# EAGLE design prutokomer (EAGLE 7.7.0)
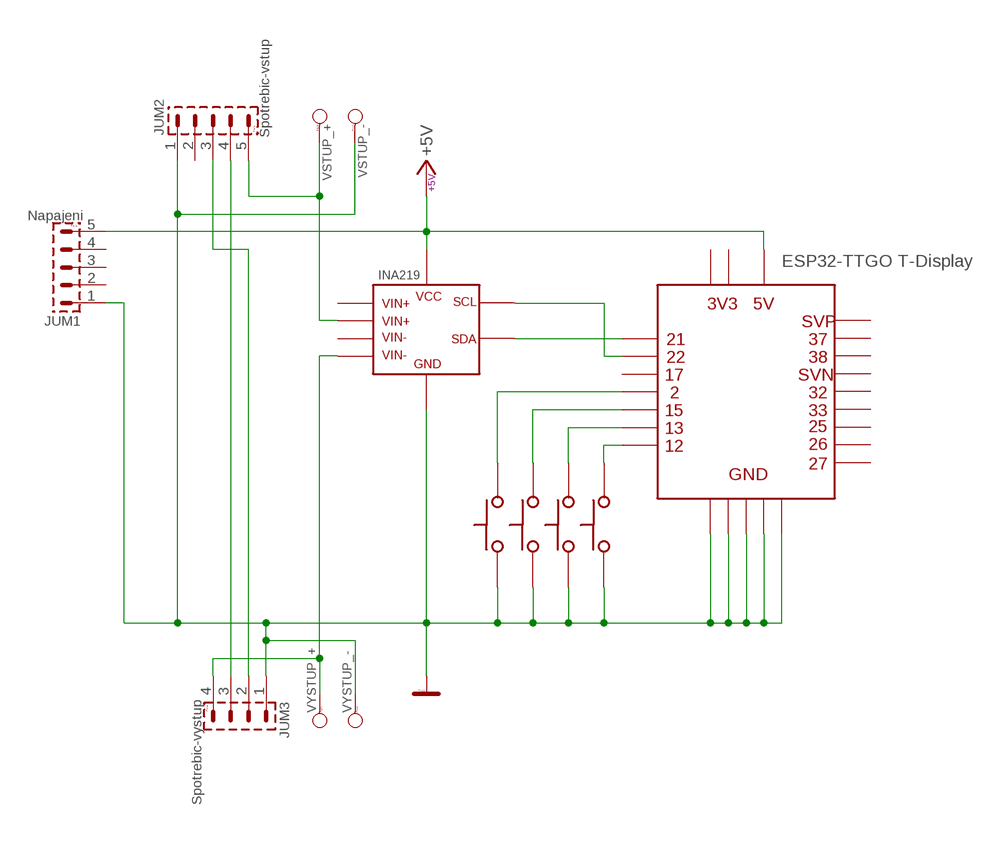
[diagram p0: schematic, sheet 1]

## Parts
JUM1  Napajeni  S1G5_JUMP  [S1G5_JUM]
JUM2  Spotrebic-vstup  S1G5_JUMP  [S1G5_JUM]
JUM3  Spotrebic-vystup  S1G4_JUMP  [S1G4_JUM]
SW1  TLACITKO  [TLACITKO]
SW2  TLACITKO  [TLACITKO]
SW3  TLACITKO  [TLACITKO]
SW4  TLACITKO  [TLACITKO]
U$1  INA219  [INA219]
U$2  ESP32_TTGOT-DISPLAY  [ESP32-TTGO-TDISPLAY]
VSTUP_+  PAD_1  [PAD_1]
VSTUP_-  PAD_1  [PAD_1]
VYSTUP_+  PAD_1  [PAD_1]
VYSTUP_-  PAD_1  [PAD_1]

## Nets
+5V: JUM1.5 U$1.VCC U$2.5V
GND: JUM1.1 JUM2.1 JUM3.1 SW1.1 SW2.1 SW3.1 SW4.1 U$1.GND U$2.GND1 U$2.GND2 U$2.GND3 U$2.GND4 U$2.GND5 VSTUP_-.1 VYSTUP_-.1
N$1: JUM2.5 U$1...VIN+(.VIN+) VSTUP_+.1
N$3: JUM3.4 U$1...VIN-(.VIN-) VYSTUP_+.1
N$4: U$1.SDA U$2.21
N$5: U$1.SCL U$2.22
N$6: JUM2.4 JUM3.3
N$7: JUM2.3 JUM3.2
N$8: SW4.2 U$2.12
N$9: SW3.2 U$2.13
N$10: SW2.2 U$2.15
N$11: SW1.2 U$2.2
Unconnected: JUM1.2 JUM1.3 JUM1.4 JUM2.2 U$1.VIN+ U$1.VIN- U$2.3V3 U$2.3V3-(3V3_2) U$2.17 U$2.25 U$2.26 U$2.27 U$2.32 U$2.33 U$2.37 U$2.38 U$2.SVN U$2.SVP

## Library data of the parts
JUM1 JUM2 = #PaJa_konektory:S1G5_JUMP: Radove konektory - koliky - 5x
JUM3 = #PaJa_konektory:S1G4_JUMP: Radove konektory - koliky - 4x
SW1-SW4 = tlacitko:TLACITKO
U$1 = INA219:INA219
U$2 = EPS32_TTGO_TDISPLAY:ESP32_TTGOT-DISPLAY
VSTUP_+ VSTUP_- VYSTUP_+ VYSTUP_- = #PaJa_31:PAD_1: Pajeci bod - 2,54 mm prumer

## Board
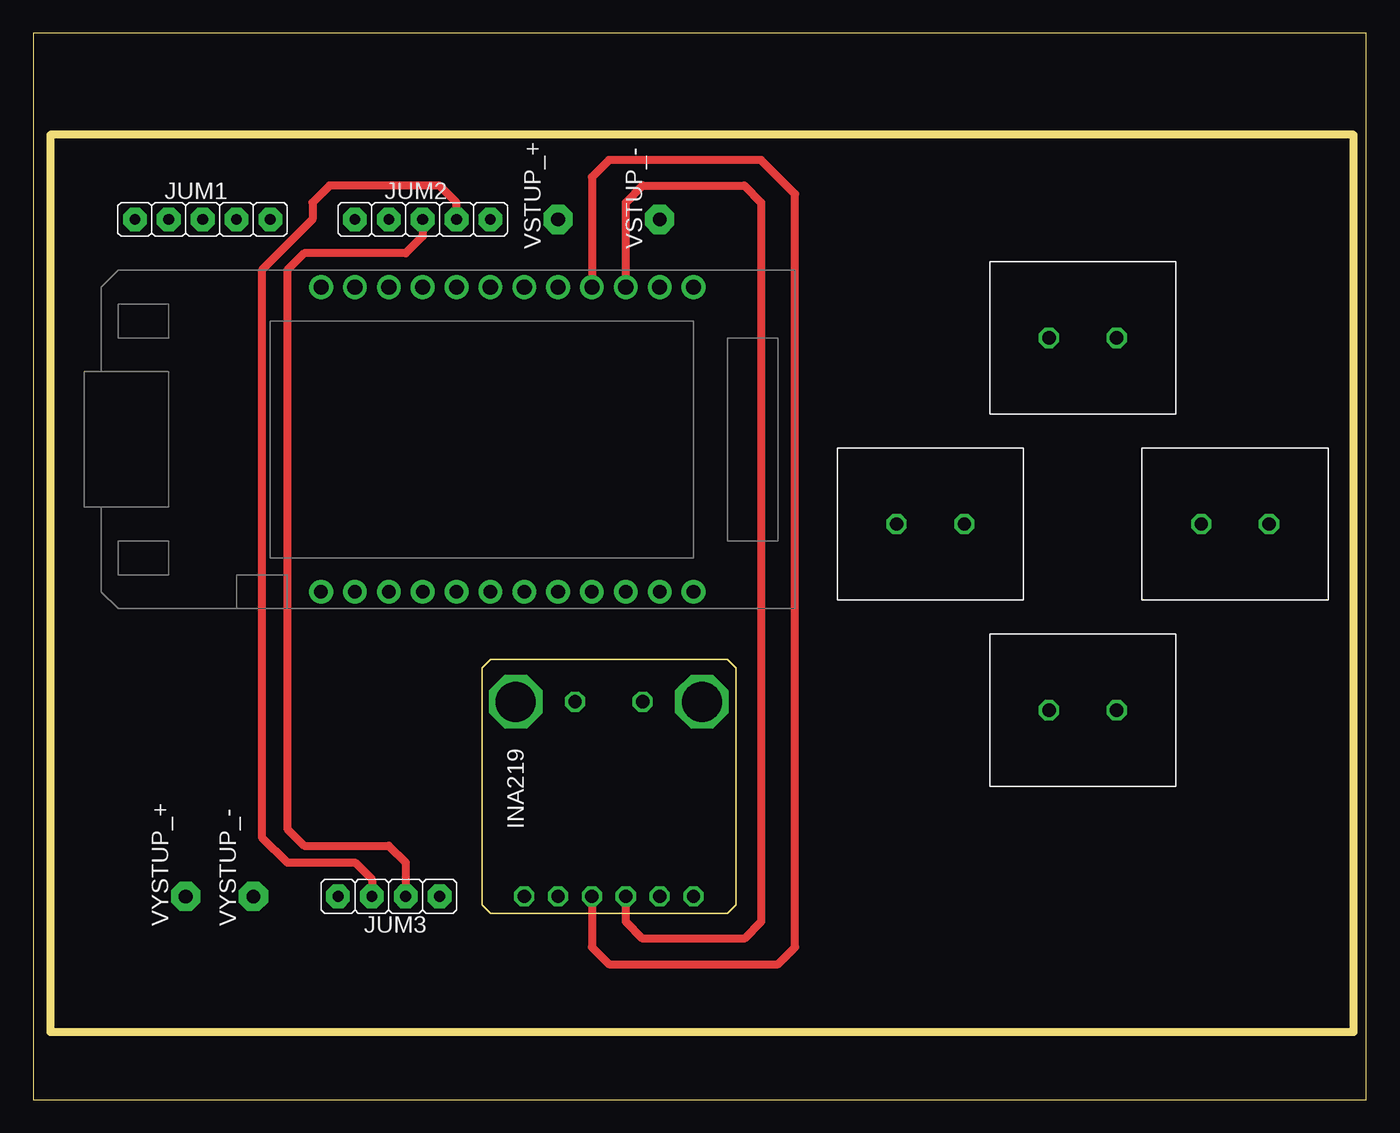
[diagram p1: board, top side]
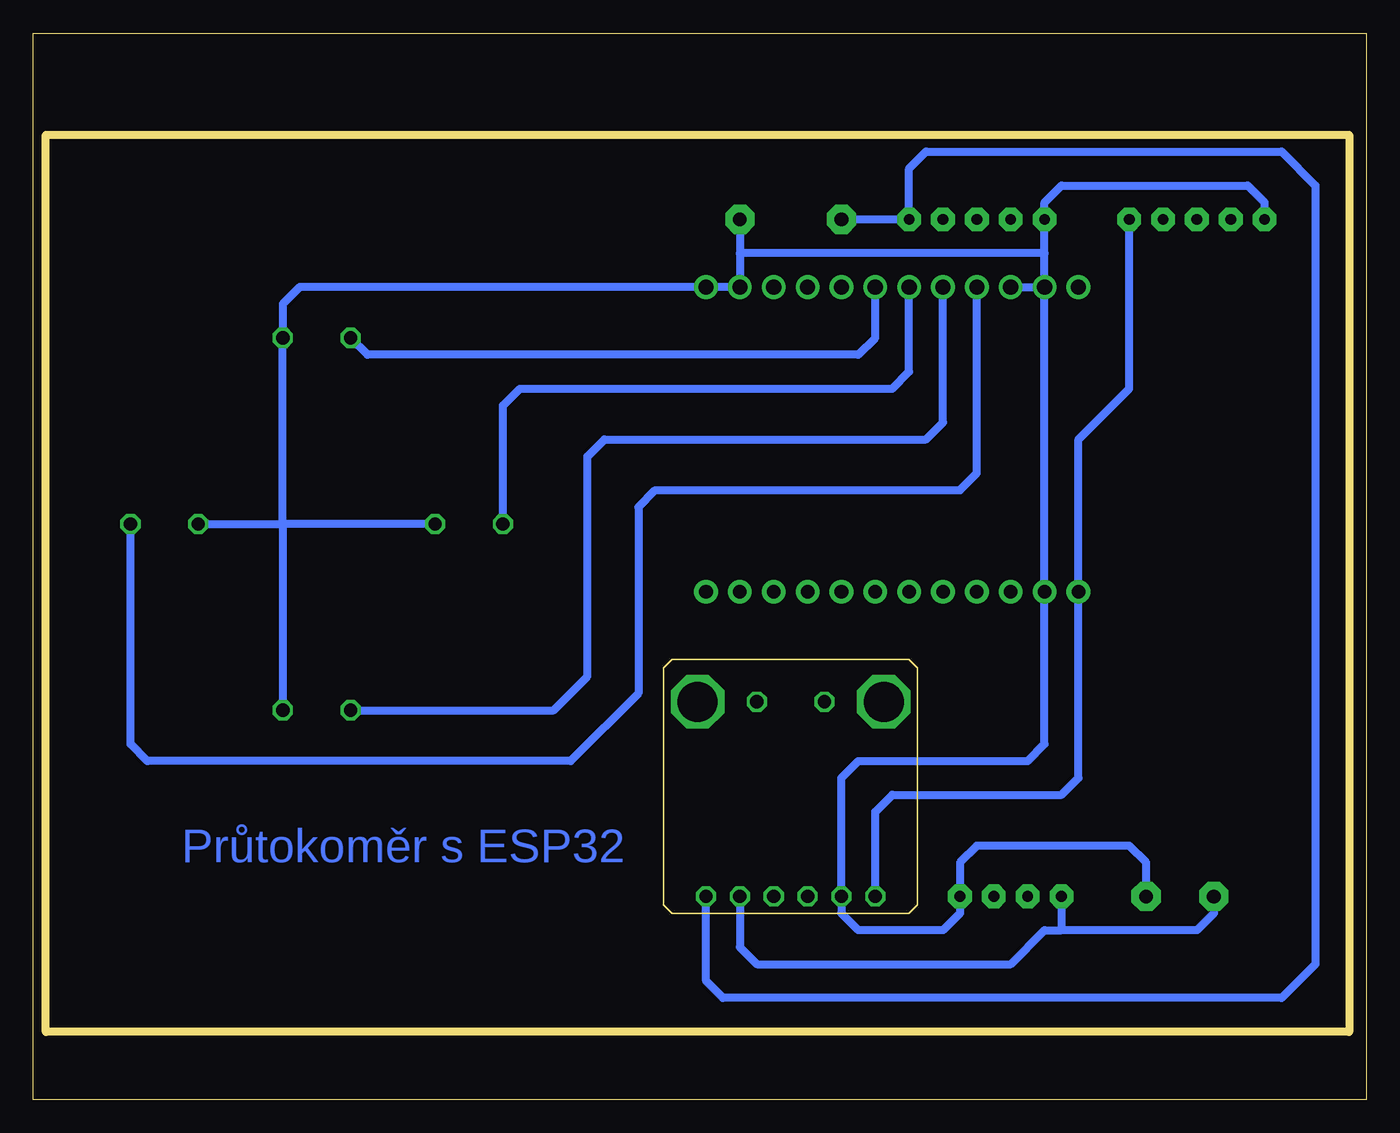
[diagram p2: board, bottom side, seen from below]

Size 100 x 80 mm. Coordinates in mm from the lower left corner, seen from the top.
Outline: 0,0 100,0 100,80 0,80 0,0
Outline: 1.27,72.39 1.27,5.08 99.06,5.08 99.06,72.39 1.27,72.39
Copper layers (1*16): Top 0.035mm / dielectric 1.5mm / Bottom 0.035mm
Design rules "default": minimum track width 10mil, minimum drill 24mil, track to track 8mil, track to pad 8mil, pad to pad 8mil, via to via 8mil, smd to smd 8mil, copper to edge 40mil, drill to drill 8mil, minimum pad ring 10mil, minimum via ring 8mil, stop-mask expansion 4mil, vias tented up to drill 0mil, thermal gap 10mil

### Footprints (pad centres in the part's own frame; a part is rotated, then mirrored left to right if it is on the bottom)
S1G5_JUM = drill 0.813 pad 1.778 octagon: 1 -5.08,0; 2 -2.54,0; 3 0,0; 4 2.54,0; 5 5.08,0
S1G4_JUM = drill 0.813 pad 1.778 octagon: 1 -3.81,0; 2 -1.27,0; 3 1.27,0; 4 3.81,0
TLACITKO = drill 1 octagon: 1 -2.54,0; 2 2.54,0
INA219 = drill 1 octagon: ..VIN+ 12.7,0; ..VIN- 10.16,0; .VIN+ 8.89,14.605; .VNI- 3.81,14.605; GND 2.54,0; SCL 5.08,0; SDA 7.62,0; VCC 0,0 | drill 3 octagon: VIN+ 13.335,14.605; VIN- -0.635,14.605
ESP32-TTGO-TDISPLAY = drill 1.143 pad 1.778: 2 0,15.24; 3V3 0,0; 12 0,7.62; 13 0,10.16; 15 0,12.7; 17 0,17.78; 21 0,22.86; 22 0,20.32; GND1 0,27.94; GND2 0,25.4; GND3 0,5.08; GND4 0,2.54 | drill 1.016 pad 1.778: 3V3- 22.86,27.94; 5V 22.86,0; 25 22.86,10.16; 26 22.86,7.62; 27 22.86,5.08; 32 22.86,15.24; 33 22.86,12.7; 37 22.86,22.86; 38 22.86,20.32; GND5 22.86,2.54; SVN 22.86,17.78; SVP 22.86,25.4
PAD_1 = drill 1.016 pad 2.184 octagon: 1 0,0

### Placement (x,y rotation side)
JUM1  12.7,66.04 0 top
JUM2  29.21,66.04 0 top
JUM3  26.67,15.24 180 top
SW1  78.74,57.15 180 top
SW2  67.31,43.18 180 top
SW3  78.74,29.21 180 top
SW4  90.17,43.18 0 top
U$1  36.83,15.24 0 top
U$2  21.59,60.96 270 top
VSTUP_+  39.37,66.04 90 top
VSTUP_-  46.99,66.04 90 top
VYSTUP_+  11.43,15.24 90 top
VYSTUP_-  16.51,15.24 90 top

### Tracks (layer width: path | path; a pad name or v marks a point on that pad's centre or on a via)
+5V
  Bottom 0.61: U$1.VCC 36.83,21.59 35.56,22.86 22.86,22.86 21.59,24.13 U$2.5V 21.59,49.53 17.78,53.34 JUM1.5
GND
  Bottom 0.61: 81.28,43.18 SW1.1 81.28,59.69 80.01,60.96 U$2.GND1 U$2.GND2 46.99,63.5 | SW2.1 81.28,43.18 | 24.13,63.5 JUM2.1 24.13,67.31 22.86,68.58 8.89,68.58 7.62,67.31 JUM1.1 | U$2.GND4 U$2.GND5 24.13,26.67 25.4,25.4 38.1,25.4 39.37,24.13 U$1.GND 39.37,13.97 38.1,12.7 31.75,12.7 30.48,13.97 JUM3.1 30.48,17.78 29.21,19.05 17.78,19.05 16.51,17.78 VYSTUP_-.1 | 81.28,43.18 SW3.1 | SW4.1 81.28,43.18 | VSTUP_-.1 46.99,63.5 | U$2.GND3 U$2.GND4 | U$2.GND4 24.13,63.5 | 24.13,63.5 46.99,63.5
N$1
  Bottom 0.61: VSTUP_+.1 JUM2.5 34.29,69.85 33.02,71.12 6.35,71.12 3.81,68.58 3.81,10.16 6.35,7.62 48.26,7.62 49.53,8.89 U$1...VIN+
N$3
  Bottom 0.61: VYSTUP_+.1 11.43,13.97 12.7,12.7 22.86,12.7 | U$1...VIN- 46.99,11.43 45.72,10.16 26.67,10.16 24.13,12.7 22.86,12.7 | JUM3.4 22.86,12.7
N$4
  Top 0.61: U$2.21 44.45,67.31 45.72,68.58 53.34,68.58 54.61,67.31 54.61,13.34 53.34,12.06 45.72,12.06 44.45,13.34 U$1.SDA
N$5
  Top 0.61: U$2.22 41.91,69.22 43.18,70.48 54.61,70.48 57.15,67.94 57.15,11.43 55.88,10.16 43.18,10.16 41.91,11.43 U$1.SCL
N$6
  Top 0.61: JUM2.4 31.75,67.31 30.48,68.58 22.23,68.58 20.95,67.31 20.95,66.04 17.14,62.23 17.14,19.68 19.05,17.78 24.13,17.78 25.4,16.51 JUM3.3
N$7
  Top 0.61: JUM2.3 29.21,64.77 27.94,63.5 20.32,63.5 19.05,62.23 19.05,20.32 20.32,19.05 26.67,19.05 27.94,17.78 JUM3.2
N$8
  Bottom 0.61: U$2.12 29.21,46.99 30.48,45.72 53.34,45.72 54.61,44.45 54.61,30.48 59.69,25.4 91.44,25.4 92.71,26.67 SW4.2
N$9
  Bottom 0.61: U$2.13 31.75,50.8 33.02,49.53 57.15,49.53 58.42,48.26 58.42,31.75 60.96,29.21 SW3.2
N$10
  Bottom 0.61: SW2.2 64.77,52.07 63.5,53.34 35.56,53.34 34.29,54.61 U$2.15
N$11
  Bottom 0.61: U$2.2 36.83,57.15 38.1,55.88 74.93,55.88 SW1.2

### Text on the board
Bottom: Průtokoměr s ESP32